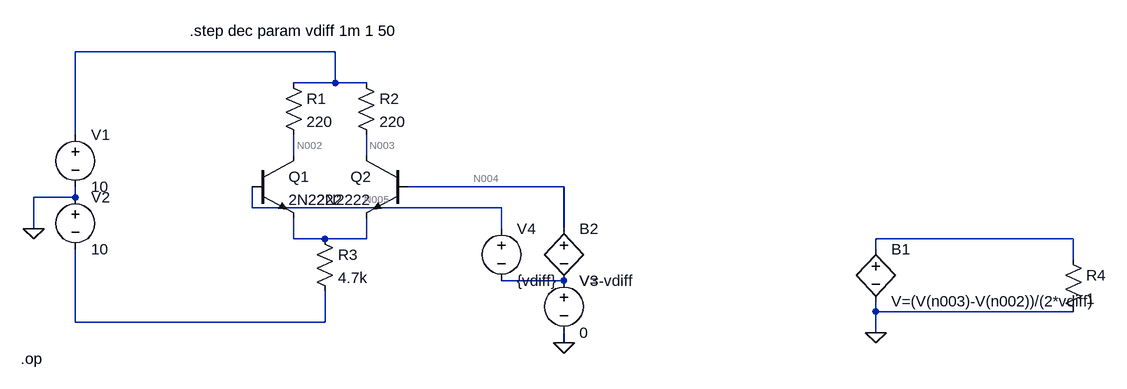
[diagram p0: schematic Draft3.asc]
Draft3.asc, the LTspice schematic file:
Version 4
SHEET 1 1484 680
WIRE 144 -64 -256 -64
WIRE 144 -16 144 -64
WIRE 144 -16 80 -16
WIRE 192 -16 144 -16
WIRE -256 64 -256 -64
WIRE 80 96 80 64
WIRE 192 96 192 64
WIRE 496 144 256 144
WIRE -256 160 -256 144
WIRE -256 160 -320 160
WIRE 16 176 16 144
WIRE 400 176 16 176
WIRE -320 208 -320 160
WIRE 400 208 400 176
WIRE 496 208 496 144
WIRE 80 224 80 192
WIRE 128 224 80 224
WIRE 192 224 192 192
WIRE 192 224 128 224
WIRE 1280 224 976 224
WIRE 976 240 976 224
WIRE 1280 256 1280 224
WIRE 496 288 400 288
WIRE 976 336 976 320
WIRE 1280 336 976 336
WIRE -256 352 -256 240
WIRE 128 352 128 304
WIRE 128 352 -256 352
WIRE 976 368 976 336
WIRE 496 384 496 368
FLAG -320 208 0
FLAG 496 384 0
FLAG 976 368 0
SYMBOL npn 16 96 R0
SYMATTR InstName Q1
SYMATTR Value 2N2222
SYMBOL npn 256 96 M0
SYMATTR InstName Q2
SYMATTR Value 2N2222
SYMBOL res 64 -32 R0
SYMATTR InstName R1
SYMATTR Value 220
SYMBOL res 176 -32 R0
SYMATTR InstName R2
SYMATTR Value 220
SYMBOL res 112 208 R0
SYMATTR InstName R3
SYMATTR Value 4.7k
SYMBOL voltage -256 48 R0
WINDOW 123 0 0 Left 0
WINDOW 39 0 0 Left 0
SYMATTR InstName V1
SYMATTR Value 10
SYMBOL voltage -256 144 R0
WINDOW 123 0 0 Left 0
WINDOW 39 0 0 Left 0
SYMATTR InstName V2
SYMATTR Value 10
SYMBOL voltage 496 272 R0
WINDOW 123 0 0 Left 0
WINDOW 39 0 0 Left 0
SYMATTR InstName V3
SYMATTR Value 0
SYMBOL voltage 400 192 R0
WINDOW 123 0 0 Left 0
WINDOW 39 0 0 Left 0
SYMATTR InstName V4
SYMATTR Value {vdiff}
SYMBOL bv 976 224 R0
SYMATTR InstName B1
SYMATTR Value V=(V(n003)-V(n002))/(2*vdiff)
SYMBOL res 1264 240 R0
SYMATTR InstName R4
SYMATTR Value 1
SYMBOL bv 496 192 R0
SYMATTR InstName B2
SYMATTR Value V=-vdiff
TEXT -340 408 Left 2 !.op
TEXT -80 -96 Left 2 !.step dec param vdiff 1m 1 50

The netlist it stands for:
* Draft3.asc
Q1 N002 N005 N006 0 2N2222
Q2 N003 N004 N006 0 2N2222
R1 N001 N002 220
R2 N001 N003 220
R3 N006 N009 4.7k
V1 N001 0 10
V2 0 N009 10
V3 N008 0 0
V4 N005 N008 {vdiff}
B1 N007 0 V=(V(n003)-V(n002))/(2*vdiff)
R4 N007 0 1
B2 N004 N008 V=-vdiff
.model NPN NPN
.model PNP PNP
.lib standard.bjt
.op
.step dec param vdiff 1m 1 50
.backanno
.end

* Results of the author's LTspice run, read from the files saved beside the schematic
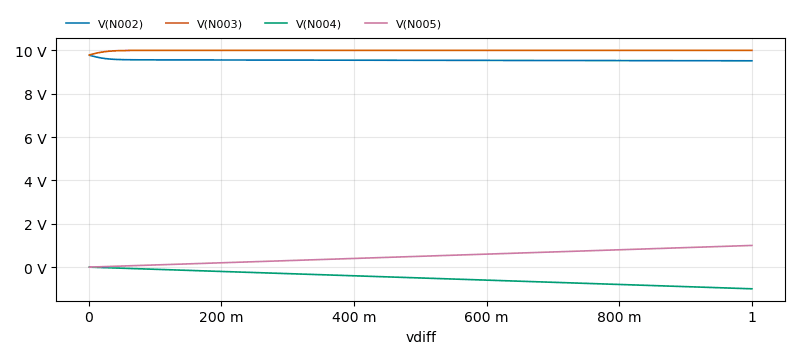
[diagram p1: Operating Point of Draft3.asc, plotted from the saved traces]
* Operating Point, 1 run:
*   V(N002): 9.774 V at vdiff=1 m, 9.519 V at vdiff=1 , min 9.519 V, max 9.774 V
*   V(N003): 9.791 V at vdiff=1 m, 10 V at vdiff=1 , min 9.791 V, max 10 V
*   V(N004): -1 mV at vdiff=1 m, -1 V at vdiff=1 , min -1 V, max -1 mV
*   V(N005): 1 mV at vdiff=1 m, 1 V at vdiff=1 , min 1 mV, max 1 V
* From the log:
*   Semiconductor Device Operating Points:
*                           --- Bipolar Transistors ---
*   Name:       q2          q1
*   Model:    2n2222      2n2222
*   Ib:       4.35e-06    4.70e-06
*   Ic:       9.52e-04    1.03e-03
*   Vbe:      6.52e-01    6.54e-01
*   Vbc:     -9.79e+00   -9.77e+00
*   Vce:      1.04e+01    1.04e+01
*   BetaDC:   2.19e+02    2.19e+02
*   Gm:       3.67e-02    3.96e-02
*   Rpi:      5.95e+03    5.51e+03
*   Rx:       1.00e+01    1.00e+01
*   Ro:       1.15e+05    1.07e+05
*   Cbe:      5.38e-11    5.50e-11
*   Cbc:      3.34e-12    3.35e-12
*   Cjs:      0.00e+00    0.00e+00
*   BetaAC:   2.18e+02    2.18e+02
*   Cbx:      0.00e+00    0.00e+00
*   Ft:       1.02e+08    1.08e+08